# Altium schematic sheet 07 - eMMC.SchDoc
size 420 x 297 mm
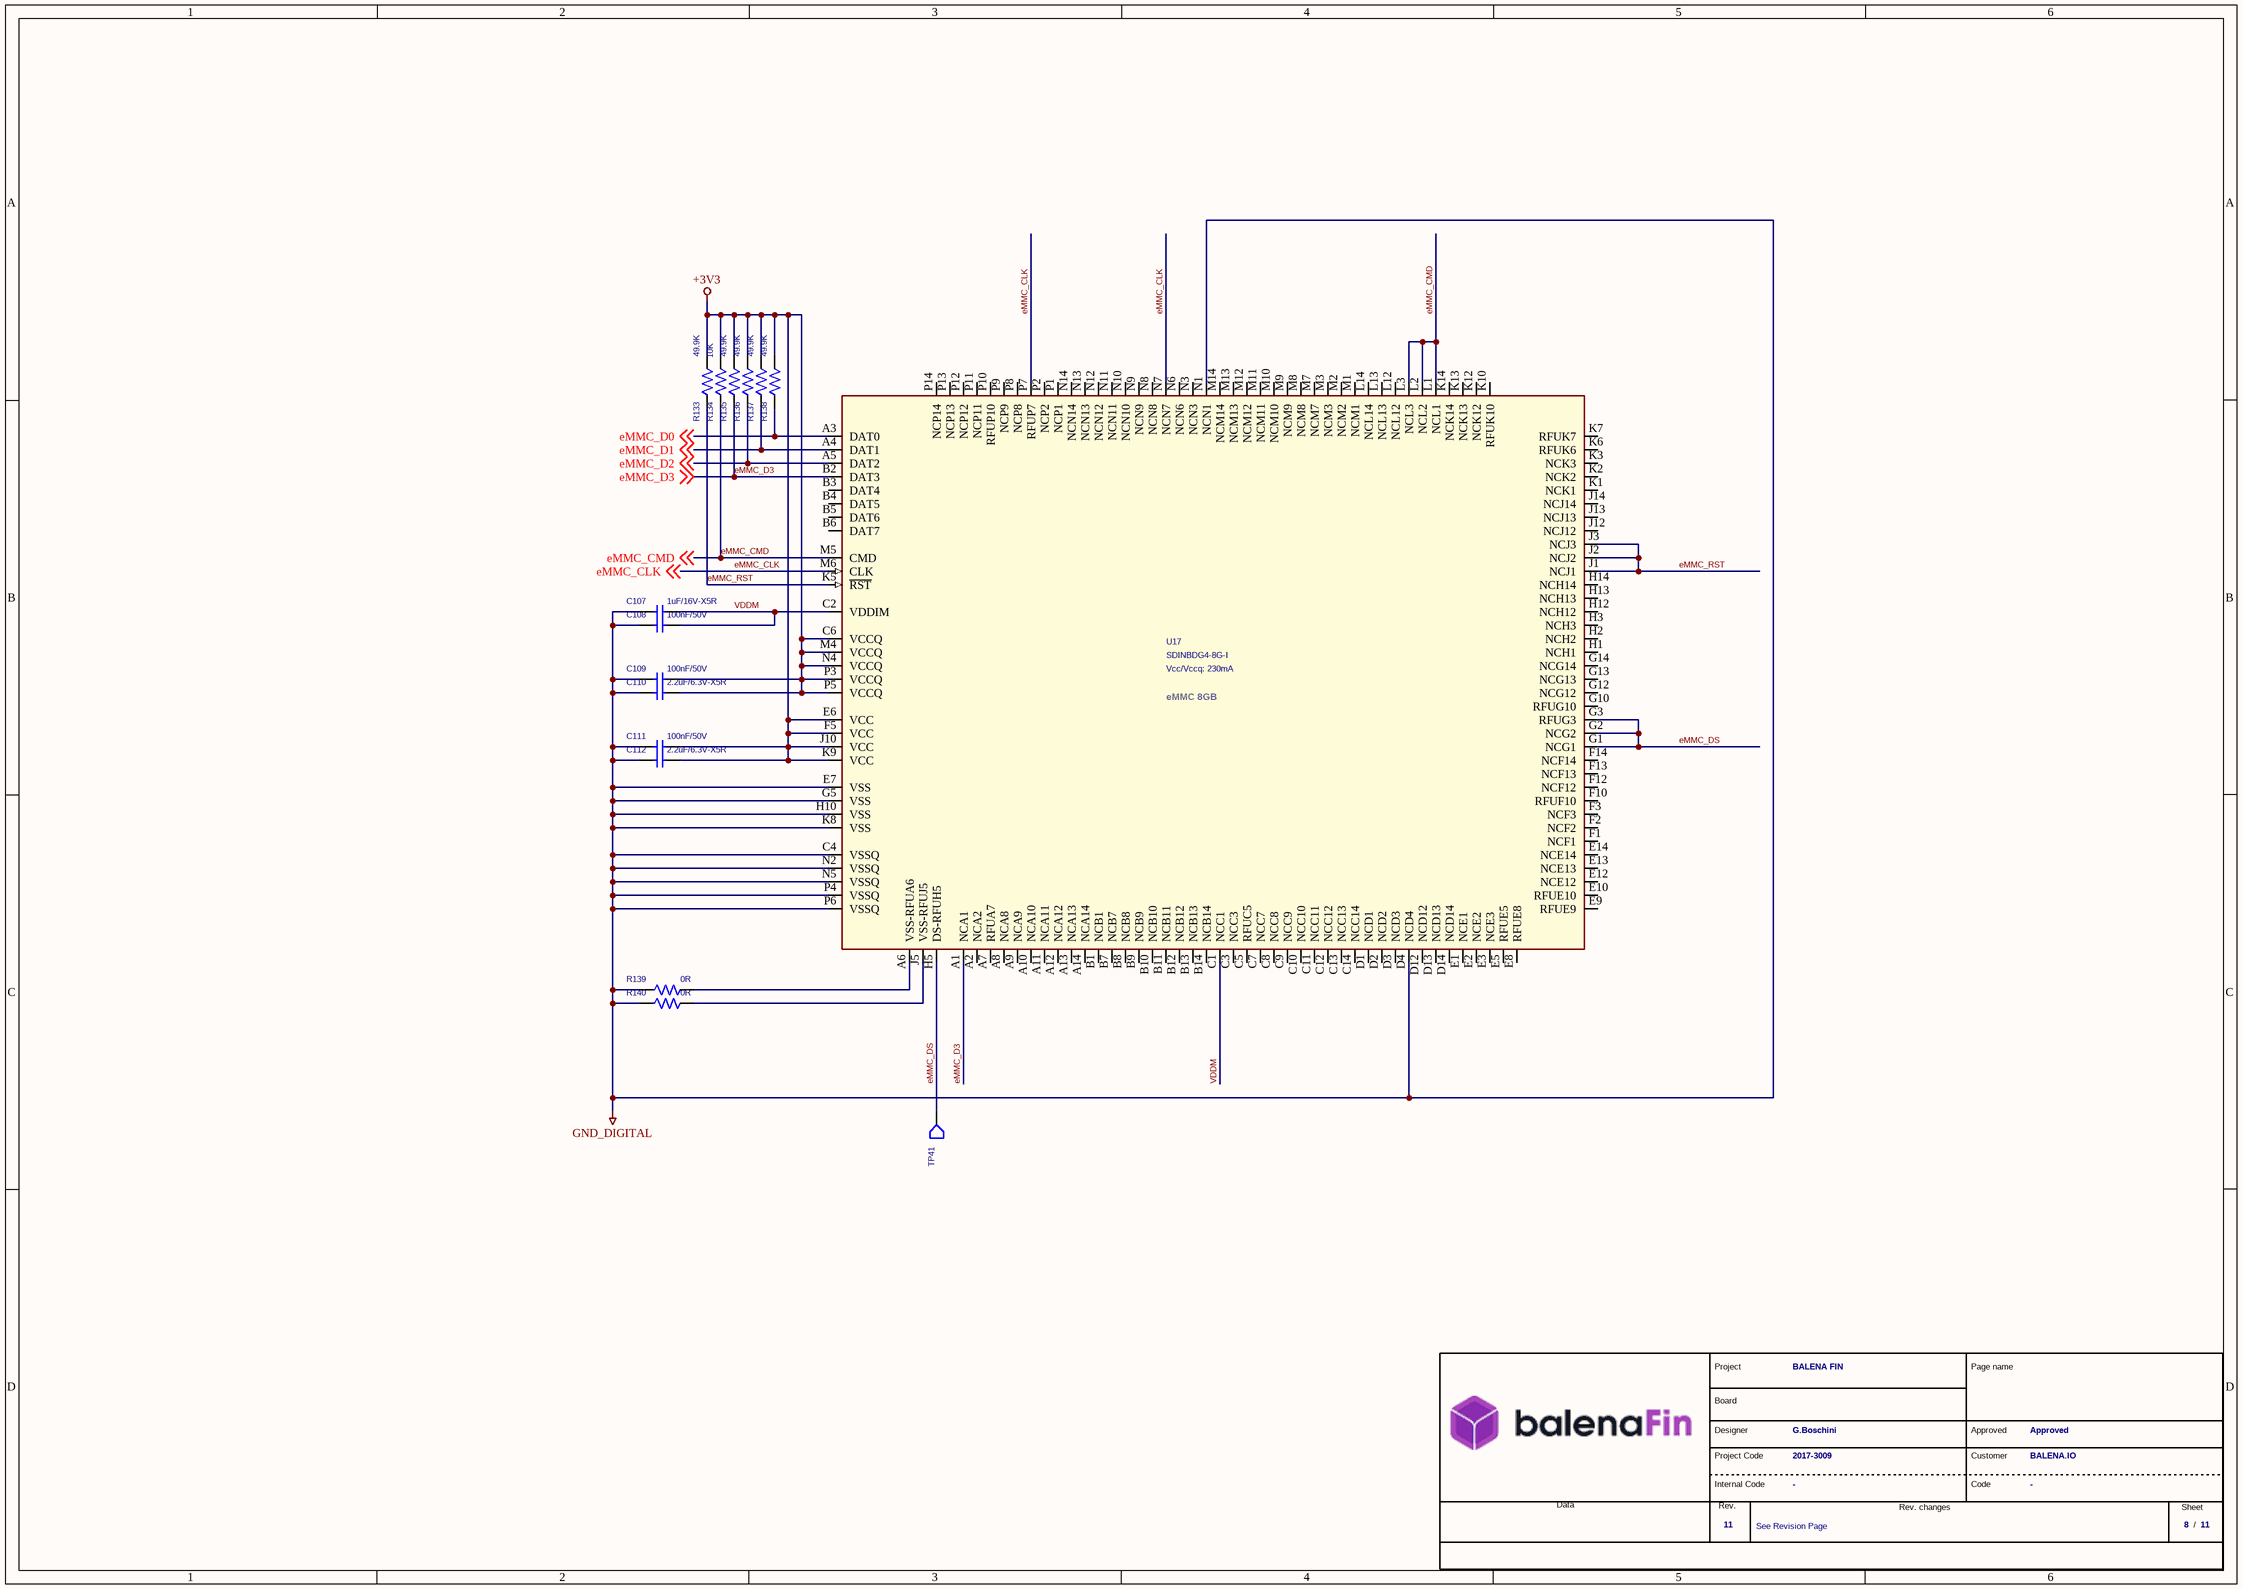
[diagram p0: 07 - eMMC.SchDoc]

## Parts
*  Revision: 11  FAE RD code: 2017-3009  DocumentoRev: See Revision Page  Page Number: 8  Nome Progetto: BALENA FIN  Customer name: BALENA.IO  Project manager: Approved  Project designer: G.Boschini  (hidden comment: MyFAEVuoto)  (graphical)
C107  1uF/16V-X5R  [CS-C-0402]
C108  100nF/50V  [CS-C-0402]
C109  100nF/50V  [CS-C-0402]
C110  2.2uF/6.3V-X5R  [CS-C-0402]
C111  100nF/50V  [CS-C-0402]
C112  2.2uF/6.3V-X5R  [CS-C-0402]
R133  49.9K  [RS-0402]
R134  10K  [RS-0402]
R135  49.9K  [RS-0402]
R136  49.9K  [RS-0402]
R137  49.9K  [RS-0402]
R138  49.9K  [RS-0402]
R139  0R  [RS-0402]
R140  0R  [RS-0402]
TP41  TPS  [TPS-0100]  (value not drawn)  (no BOM)
U17  SDINBDG4-8G-I  Power requirements: Vcc/Vccq: 230mA  [VFBGA153]

## Nets
+3V3: C109.2 C110.2 C111.2 C112.2 R133.2 R134.2 R135.2 R136.2 R137.2 R138.2 U17.C6(VCCQ) U17.E6(VCC) U17.F5(VCC) U17.J10(VCC) U17.K9(VCC) U17.M4(VCCQ) U17.N4(VCCQ) U17.P3(VCCQ) U17.P5(VCCQ)
GND_DIGITAL: C107.1 C108.1 C109.1 C110.1 C111.1 C112.1 R139.1 R140.1 U17.C4(VSSQ) U17.D4(NCD4) U17.E7(VSS) U17.G5(VSS) U17.H10(VSS) U17.K8(VSS) U17.N1(NCN1) U17.N2(VSSQ) U17.N5(VSSQ) U17.P4(VSSQ) U17.P6(VSSQ)
eMMC_CLK: U17.M6(CLK) U17.N7(NCN7) U17.P7(RFUP7) ; off-sheet eMMC_CLK
eMMC_CMD: R134.1 U17.L1(NCL1) U17.L2(NCL2) U17.L3(NCL3) U17.M5(CMD) ; off-sheet eMMC_CMD
eMMC_D0: R138.1 U17.A3(DAT0) ; off-sheet eMMC_D0
eMMC_D1: R137.1 U17.A4(DAT1) ; off-sheet eMMC_D1
eMMC_D2: R136.1 U17.A5(DAT2) ; off-sheet eMMC_D2
eMMC_D3: R135.1 U17.A1(NCA1) U17.B2(DAT3) ; off-sheet eMMC_D3
eMMC_DS: TP41.1(TP) U17.G1(NCG1) U17.G2(NCG2) U17.G3(RFUG3) U17.H5(DS-RFUH5)
eMMC_RST: R133.1 U17.J1(NCJ1) U17.J2(NCJ2) U17.J3(NCJ3) U17.K5(~{RST})
VDDM: C107.2 C108.2 U17.C1(NCC1) U17.C2(VDDIM)
NetR139_2: R139.2 U17.A6(VSS-RFUA6)
NetR140_2: R140.2 U17.J5(VSS-RFUJ5)

Not connected (* = marked no-connect by the designer): U17 A2(NCA2) A7(RFUA7) A8(NCA8) A9(NCA9) A10(NCA10) A11(NCA11) A12(NCA12) A13(NCA13) A14(NCA14) B1(NCB1) B3(DAT4) B4(DAT5) B5(DAT6) B6(DAT7) B7(NCB7) B8(NCB8) B9(NCB9) B10(NCB10) B11(NCB11) B12(NCB12) B13(NCB13) B14(NCB14) C3(NCC3) C5(RFUC5) C7(NCC7) C8(NCC8) C9(NCC9) C10(NCC10) C11(NCC11) C12(NCC12) C13(NCC13) C14(NCC14) D1(NCD1) D2(NCD2) D3(NCD3) D12(NCD12) D13(NCD13) D14(NCD14) E1(NCE1) E2(NCE2) E3(NCE3) E5(RFUE5) E8(RFUE8) E9(RFUE9) E10(RFUE10) E12(NCE12) E13(NCE13) E14(NCE14) F1(NCF1) F2(NCF2) F3(NCF3) F10(RFUF10) F12(NCF12) F13(NCF13) F14(NCF14) G10(RFUG10) G12(NCG12) G13(NCG13) G14(NCG14) H1(NCH1) H2(NCH2) H3(NCH3) H12(NCH12) H13(NCH13) H14(NCH14) J12(NCJ12) J13(NCJ13) J14(NCJ14) K1(NCK1) K2(NCK2) K3(NCK3) K6(RFUK6) K7(RFUK7) K10(RFUK10) K12(NCK12) K13(NCK13) K14(NCK14) L12(NCL12) L13(NCL13) L14(NCL14) M1(NCM1) M2(NCM2) M3(NCM3) M7(NCM7) M8(NCM8) M9(NCM9) M10(NCM10) M11(NCM11) M12(NCM12) M13(NCM13) M14(NCM14) N3(NCN3) N6(NCN6) N8(NCN8) N9(NCN9) N10(NCN10) N11(NCN11) N12(NCN12) N13(NCN13) N14(NCN14) P1(NCP1) P2(NCP2) P8(NCP8) P9(NCP9) P10(RFUP10) P11(NCP11) P12(NCP12) P13(NCP13) P14(NCP14)

## Notes on the sheet
- (in symbol eMMC - SDINBDG4-8G-I - 8GB) eMMC 8GB
- (in symbol MyFAEVuoto) Project; Page name; Board; Designer; Project Code; Customer; Internal Code; Code; Data; Rev.; Rev. changes; Sheet; /

## Library data of the parts
C107 = CS-C-0402-1u/16-X5R: CHIP CAP.CER. 1uF 16V 10% X5R 0402; MPN: Generic; Pkg Type: SMD; Room: eMMC; Mount: Yes
C108 C109 C111 = CS-C-0402-100n/16V: CHIP CAP.CER. 100nF 16V 10% X7R 0402; MPN: Generic; Alternative MPN: C0402C104K4RACTU; Room: eMMC; Pkg Type: SMD; Mount: Yes
C110 C112 = CS-C-0402-2.2u/6V3-X5R: CHIP CAP.CER. 2.2uF 6.3V 20% X5R 0402; MPN: Generic; Room: eMMC; Pkg Type: SMD; Mount: Yes
R133 R135-R138 = RS-0402-49.9k: CHIP RES. 49K9 0402 1/16W 1% 100PPM/°C; MPN: Generic; Room: eMMC; Note: 100 ppm; Pkg Type: SMD; Temperature range: -55°..+155°; Mount: Yes
R134 = RS-0402-10k: CHIP RES. 10K 0402 1/16W 1%; MPN: Generic; Room: eMMC; Pkg Type: SMD; Temperature range: -55°..+125°; Mount: Yes
R139 R140 = RS-0402-0r: CHIP RES. 0R 0402 1/16W 1%; MPN: Generic; Room: eMMC; Pkg Type: SMD; Mount: Yes
TP41 = TEST POINT SMD 1 MM: TEST POINT SMD; MPN: TP-No-BoM; Room: eMMC; Pkg Type: SMD; Mount: Yes
U17 = eMMC - SDINBDG4-8G-I - 8GB: IC eMMC SDINBDG4-8G SANDISK VFBGA153 SMT; Note: Standard 5.1 - VCC=2.7V-3.6V - VCCQ=1.7V-1.95V/2.7V-3.6V; Pkg Type: SMD; Room: eMMC; Temperature range: -25°..+85°; MPN: SDINBDG4-8G-I; Mount: Yes
* = MyFAEVuoto: Page Count: 11; Customer Code: -; Database: -